# Altium schematic sheet Power_Supply.SchDoc
size A; SheetNumber: 1; SheetTotal: 3
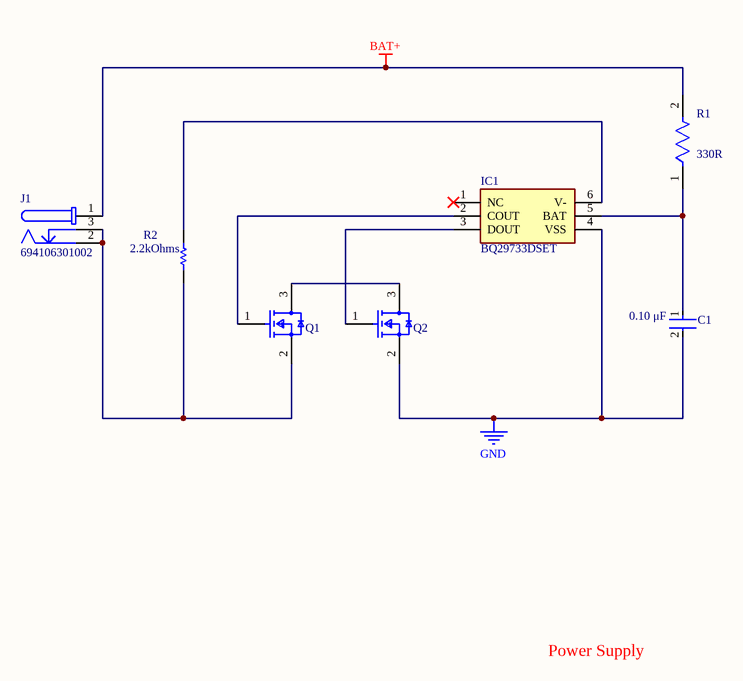
[diagram p0: Power_Supply.SchDoc]

## Parts
C1  Capacitance: 0.10 μF  [FP-C0603C-CF-MFG]  (hidden comment: C0603C104K5RACTU)
IC1  BQ29733DSET  [SON50P150X150X80-6N]
J1  694106301002  [694106301002]
Q1  2N7002-7-F  [FP-SOT23-MFG]  (value not drawn)
Q2  2N7002-7-F  [FP-SOT23-MFG]  (value not drawn)
R1  value 330R  [FP-ERA3A-MFG]  (hidden comment: ERA-3AEB331V)
R2  Resistance: 2.2kOhms  [RESC1608X55X25LL10T15]  (hidden comment: RC0603FR-072K2L)

## Nets
BAT+: J1.1 R1.2
GND: C1.2 IC1.4(VSS) Q2.2(S)
NetC1_1: C1.1 IC1.5(BAT) R1.1
NetIC1_2: IC1.2(COUT) Q1.1(G)
NetIC1_3: IC1.3(DOUT) Q2.1(G)
NetIC1_6: IC1.6(V-) R2.2
NetJ1_2: J1.2 J1.3 Q1.2(S) R2.1
NetQ1_3: Q1.3(D) Q2.3(D)

Not connected (* = marked no-connect by the designer): IC1 1(NC)*

## Notes on the sheet
- Power Supply

## Library data of the parts
C1 = CMP-2006-03061-2: CAP CER 0.1UF 50V X7R 0603; Manufacturer: KEMET; Tolerance: 0.1; Temperature Coefficient: 30ppm/°C; Material: Ceramic; Automotive Grade: Grade 1; Value: 0.10 μF; Multilayer: Yes; Tolerance  (fill in as +-): 10%; Temperature: -55°C to +125°C; RoHS: TRUE; Temperature Range High: +125°C; Lead Free: Yes; Octopart: https://octopart.com/c0603c104k5ractu-kemet-139244; Digikey Description: CAP CER 0.1UF 50V X7R 0603; Category: Cap; Package: C0603C-CF; ComponentLink2Description: Datasheet; Temperature Range Low: -55°C; Device Class L1: Passive Components; Voltage Rating: 50 V; Automotive: Yes; Device Class L3: Ceramic Capacitors; ComponentLink2URL: https://api.kemet.com/component-edge/download/datasheet/C0603C100J5GACAUTO.pdf; Device Class L2: Capacitors; Manufacturer Part Number: C0603C104K5RACTU; Temperature Characteristic: X7R; Height: 0.87mm; Supplier: Digikey; Supplier Part Number: 399-C0603C104K5RAC7867DKR-ND; Stock: 3980940; Pricing: 1=0.11, 10=0.074, 50=0.0424, 100=0.0329, 500=0.02474, 1000=0.01944 (USD); Mounting Technology: Surface Mount; Pins: 2; Dielectric Material: Ceramic; Package Shape: Rectangular; Case/Package: 0603; Terminal Finish: Nickel; Min Operating Temperature: -55°C; Max Operating Temperature: 125°C; JESD-609 Code: e3; Capacitor Type: Ceramic; Package Style: SMTMeter; Packaging: Tape and Reel; Tolerance (fill in as +-): 10%; Rated DC Voltage (URdc): 50V; Temperature Characteristics Code: X7R; Termination: Wraparound; Length: 1.6mm; Width: 0.8mm; Reach SVHC Compliant: Yes; RoHS Compliant: Yes; ComponentLink1URL: https://datasheet.ciiva.com:443/pdfs/VipMasterIC/IC/KEME/KEME-S-A0008991654/KEME-S-A0008991654-1.pdf?src-supplier=IHS+Markit; ComponentLink1Description: https://datasheet.ciiva.com:443/pdfs/VipMasterIC/IC/KEME/KEME-S-A0008991654/KEME-S-A0008991654-1.pdf?src-supplier=IHS+Markit
IC1 = BQ29733DSET: Power Supply Support Circuit, Fixed, 1 Channel, PDSO6; Manufacturer_Name: Texas Instruments; Package Body Material: Plastic; Adjustable Threshold: No; Number of Channels: 1; Max Supply Voltage: 8V; Min Supply Voltage: 1.5V; Nominal Supply Voltage: 3.6V; Datasheet Link: https://www.ti.com/lit/ds/symlink/bq2973.pdf?ts=1626159689941&ref_url=https%253A%252F%252Fwww.ti.com%252Fsitesearch%252Fdocs%252Funiversalsearch.tsp%253FlangPref%253Den-US%2526searchTerm%253DBQ29733DSET%2526nr%253D6; Height: 0.8mm; Manufacturer_Part_Number: BQ29733DSET; Mouser Part Number: 595-BQ29733DSET; Mouser Price/Stock: https://www.mouser.co.uk/ProductDetail/Texas-Instruments/BQ29733DSET?qs=zEmsApcVOkXfiFtBIYC8VA%3D%3D; Arrow Part Number: BQ29733DSET; Arrow Price/Stock: https://www.arrow.com/en/products/bq29733dset/texas-instruments?region=nac; Supplier: Digikey; Supplier Part Number: 296-BQ29733DSETCT-ND; Manufacturer: Texas Instruments; Manufacturer Part Number: BQ29733DSET; RoHS: Yes; Category: Battery Management; Stock: 5226; Pricing: 1=1.2, 10=1.076, 25=1.0208, 100=0.8386 (USD); Case/Package: VSON; Pins: 6; Package Shape: Square; Terminal Finish: Nickel; Min Operating Temperature: -40°C; Max Operating Temperature: 85°C; JESD-609 Code: e4; Throw Configuration: POWER SUPPLY SUPPORT CIRCUIT; JESD-30 Code: S-PDSO-N6; Moisture Sensitivity Level: 1; Channels: 1; Package Style: SMALL OUTLINE, VERY THIN PROFILEMeter; Peak Reflow Temperature (Cel): 260°C; Surface Mount: Yes; Terminal Form: No Lead; Terminal Position: DUAL; Length: 1.5mm; Width: 1.5mm; Height - Seated (Max): 0.8mm; Terminal Pitch: 0.5mm; Temperature Grade: INDUSTRIAL; Reach SVHC Compliant: Yes; RoHS Compliant: Yes; ComponentLink1URL: https://www.ti.com:443/lit/ds/symlink/bq2970.pdf?src-supplier=IHS+Markit; ComponentLink1Description: https://www.ti.com:443/lit/ds/symlink/bq2970.pdf?src-supplier=IHS+Markit; ComponentLink2URL: http://www.ti.com/lit/ds/symlink/bq2970.pdf?src-supplier=Digikey; ComponentLink2Description: http://www.ti.com/lit/ds/symlink/bq2970.pdf?src-supplier=Digikey
J1 = CMP-1502-00188-2: NexarPartId: 52676100; Manufacturer: Wurth Electronics; Voltage Rating (DC): 20V; Gender: Male; Voltage Rating: 24V; Connector Type: Power; Insulation Resistance: 100MΩ; Current Rating: 5A; Shielding: Unshielded; Number of Contacts: 3; Color: Black; Housing Material: Polyamide; Contact Gender: Female; REACH SVHC: Unknown; Termination: Through Hole; Height: 11mm; RoHS: Compliant; Mount: Through Hole; Flammability Rating: UL94 V-0; Packaging: Bulk; Min Operating Temperature: -40°C; Contact Plating: Tin; Max Operating Temperature: 85°C; Operating Supply Voltage: 24V; Contact Material: Gold, Tin; Supplier: Digikey; Supplier Part Number: 732-5930-ND; Manufacturer Part Number: 694106301002; Category: Power Connectors; Stock: 13785; Pricing: 1=1.02, 10=0.97, 50=0.86, 100=0.8, 500=0.69, 1000=0.59 (USD); Contact Finish - Mating: NOT SPECIFIED; Reach SVHC Compliant: Yes; RoHS Compliant: Yes; ComponentLink1URL: https://datasheet.ciiva.com:443/pdfs/VipMasterIC/IC/MIDC/MIDC-S-A0001192814/MIDC-S-A0001192814-1.pdf?src-supplier=IHS+Markit; ComponentLink1Description: https://datasheet.ciiva.com:443/pdfs/VipMasterIC/IC/MIDC/MIDC-S-A0001192814/MIDC-S-A0001192814-1.pdf?src-supplier=IHS+Markit; ComponentLink2URL: http://www.mouser.com/ds/2/445/6941xx301002-469315.pdf?src-supplier=Mouser; ComponentLink2Description: http://www.mouser.com/ds/2/445/6941xx301002-469315.pdf?src-supplier=Mouser; ComponentLink3URL: http://www.farnell.com/cad/2130967.pdf?src-supplier=Element14; ComponentLink3Description: http://www.farnell.com/cad/2130967.pdf?src-supplier=Element14; ComponentLink4URL: https://katalog.we-online.de/em/datasheet/6941xx301002.pdf?src-supplier=Digikey; ComponentLink4Description: https://katalog.we-online.de/em/datasheet/6941xx301002.pdf?src-supplier=Digikey
Q1 Q2 = CMP-2000-04929-2: MOSFET N-CH 60V 115MA SOT23-3; Manufacturer: Diodes; Turn-On Delay Time: 7ns; Turn-Off Delay Time: 11ns; Drain to Source Resistance: 7.5R; Rise Time: 3ns; Drain to Source Breakdown Voltage: 70V; Input Capacitance: 50pF; Number of Elements: 1; Power Dissipation: 540mW; Max Power Dissipation: 300mW; Fall Time: 5.6ns; Gate to Source Voltage (Vgs): 20V; Threshold Voltage: 2.5V; Element Configuration: Single; Package Body Material: Plastic; Transistor Element Material: SILICON; Operating Mode: ENHANCEMENT MODE; Time @ Peak Reflow Temperature-Max (s): 40s; Polarity/Channel Type: N-CHANNEL; Drain-source On Resistance-Max: 13.5R; Feedback Cap-Max (Crss): 5pF; FET Technology: METAL-OXIDE SEMICONDUCTOR; Transistor Application: SWITCHING; Qualification Status: Not Qualified; Termination: SMD/SMT; Weight: 0.000282oz; Radiation Hardening: No; Max Operating Temperature: 150°C; On-State Resistance: 7.5R; Mount: Surface Mount; Current Rating: 115mA; Contact Plating: Tin; Lead Free: Lead Free; Min Operating Temperature: -55°C; Number of Pins: 3; REACH SVHC: No SVHC; Drain to Source Voltage (Vdss): 60V; Width: 1.3mm; Package Quantity: 3000; Length: 2.9mm; Case/Package: SOT-23; Number of Channels: 1; Dual Supply Voltage: 60V; Packaging: Tape and Reel; Height: 1mm; Voltage Rating (DC): 60V; Nominal Vgs: 2.5V; Continuous Drain Current (ID): 115mA; Voltage: 60V; Rds On Max: 7.5R; Supplier: Digikey; Supplier Part Number: 2N7002-FDICT-ND; Manufacturer Part Number: 2N7002-7-F; RoHS: Yes; Category: MOSFETs; Stock: 590159; Pricing: 1=0.2, 10=0.139, 100=0.075, 500=0.0589, 1000=0.0409 (USD); Pins: 3; Package Shape: Rectangular; Terminal Finish: Tin; JESD-609 Code: e3; JESD-30 Code: R-PDSO-G3; Package Style: SMALL OUTLINEMeter; Peak Reflow Temperature (Cel): 260°C; Surface Mount: Yes; Terminal Form: Gull Wing; Terminal Position: DUAL; Drain Current-Max (Abs) (ID): 115mA; Drain Current-Max (ID): 115mA; DS Breakdown Voltage-Min: 60V; Moisture Sensitivity Level: 1; Power Dissipation-Max (Abs): 300mW; RoHS Compliant: Yes; Reach SVHC Compliant: Yes; ComponentLink1URL: https://datasheet.ciiva.com:443/pdfs/VipMasterIC/IC/DIOD/DIOD-S-A0009689736/DIOD-S-A0009691859-1.pdf?src-supplier=IHS+Markit; ComponentLink1Description: https://datasheet.ciiva.com:443/pdfs/VipMasterIC/IC/DIOD/DIOD-S-A0009689736/DIOD-S-A0009691859-1.pdf?src-supplier=IHS+Markit; ComponentLink2URL: https://datasheet.ciiva.com/15219/getdatasheetpartid-110059-15219667.pdf?src-supplier=Verical; ComponentLink2Description: https://datasheet.ciiva.com/15219/getdatasheetpartid-110059-15219667.pdf?src-supplier=Verical; ComponentLink3URL: https://datasheet.ciiva.com/3304/ds11303-3304385.pdf?src-supplier=Avnet; ComponentLink3Description: https://datasheet.ciiva.com/3304/ds11303-3304385.pdf?src-supplier=Avnet; ComponentLink4URL: https://datasheet.ciiva.com/1188/ds11303-1188363.pdf?src-supplier=Element14; ComponentLink4Description: https://datasheet.ciiva.com/1188/ds11303-1188363.pdf?src-supplier=Element14; ComponentLink5URL: https://datasheet.ciiva.com/22712/1915452-22712375.pdf?src-supplier=Element14; ComponentLink5Description: https://datasheet.ciiva.com/22712/1915452-22712375.pdf?src-supplier=Element14; ComponentLink6URL: https://datasheet.ciiva.com/49020/70437206-49020102.pdf?src-supplier=Allied+Electronics; ComponentLink6Description: https://datasheet.ciiva.com/49020/70437206-49020102.pdf?src-supplier=Allied+Electronics
R1 = CMP-2000-00036-3: NexarPartId: 1187882; Manufacturer: Panasonic; Voltage Rating (DC): 75V; Max Power Dissipation: 100mW; Resistance: 330Ω; Temperature Coefficient: 25ppm/°C; Tolerance: 0.1%; Rated Temperature: 85°C; Package Height: 0.45mm; Package Length: 1.6mm; Package Width: 0.8mm; Reference Standard: AEC-Q200; Features: Automotive AEC-Q200; Packaging: Cut Tape; Composition: Thin Film; Case Code (Imperial): 0603; Number of Terminations: 2; Termination: SMD/SMT; Military Standard: Not; Radiation Hardening: No; Voltage Rating: 75V; Width: 800µm; Schedule B: 8533210045, 8533210045; Min Operating Temperature: -55°C; Number of Pins: 2; Contact Plating: Tin; Length: 1.6mm; Case Code (Metric): 1608; Mount: Surface Mount; Lead Free: Lead Free; Power Rating: 100mW; Height: 450µm; Depth: 800µm; Max Operating Temperature: 155°C; RoHS: Compliant; Lifecycle Status: Production; REACH SVHC: No SVHC; Case/Package: 0603; Supplier: Digikey; Supplier Part Number: P330DBCT-ND; Manufacturer Part Number: ERA-3AEB331V; Category: Chip SMD Resistors; Stock: 139150; Pricing: 1=0.13, 10=0.094, 50=0.0742, 100=0.0665, 500=0.05062, 1000=0.04473 (USD); Mounting Technology: Surface Mount; Pins: 2; Terminal Finish: Nickel; Resistor Type: FIXED RESISTOR; Power: 100mW; Technology: THIN FILM; Working Voltage: 75V; Construction: Rectangular; Package Style: SMTMeter; JESD-609 Code: e3; RoHS Compliant: Yes; Reach SVHC Compliant: Yes; ComponentLink1URL: https://datasheet.ciiva.com:443/pdfs/VipMasterIC/IC/PANA/PANA-S-A0009459258/PANA-S-A0009459258-1.pdf?src-supplier=IHS+Markit; ComponentLink1Description: https://datasheet.ciiva.com:443/pdfs/VipMasterIC/IC/PANA/PANA-S-A0009459258/PANA-S-A0009459258-1.pdf?src-supplier=IHS+Markit; ComponentLink2URL: https://datasheet.ciiva.com/11808/0900766b80fe20f7-11808048.pdf?src-supplier=Rs; ComponentLink2Description: https://datasheet.ciiva.com/11808/0900766b80fe20f7-11808048.pdf?src-supplier=Rs; ComponentLink3URL: https://datasheet.ciiva.com/29183/450515-da-01-en-widerstand-0603-era-29183685.pdf?src-supplier=Conrad; ComponentLink3Description: https://datasheet.ciiva.com/29183/450515-da-01-en-widerstand-0603-era-29183685.pdf?src-supplier=Conrad; ComponentLink4URL: https://datasheet.ciiva.com/43455/485442-43455214.pdf?src-supplier=Farnell; ComponentLink4Description: https://datasheet.ciiva.com/43455/485442-43455214.pdf?src-supplier=Farnell; ComponentLink5URL: https://datasheet.ciiva.com/6000/485442-6000917.pdf?src-supplier=Farnell; ComponentLink5Description: https://datasheet.ciiva.com/6000/485442-6000917.pdf?src-supplier=Farnell; ComponentLink6URL: https://datasheet.ciiva.com/48530/era-eng-tds-48530552.pdf?src-supplier=Distrelec; ComponentLink6Description: https://datasheet.ciiva.com/48530/era-eng-tds-48530552.pdf?src-supplier=Distrelec; ComponentLink7URL: https://datasheet.ciiva.com/48425/era-eng-tds-48425455.pdf?src-supplier=Distrelec; ComponentLink7Description: https://datasheet.ciiva.com/48425/era-eng-tds-48425455.pdf?src-supplier=Distrelec; ComponentLink8URL: https://datasheet.ciiva.com/16395/aoa0000ce26-16395257.pdf?src-supplier=Future+Electronics; ComponentLink8Description: https://datasheet.ciiva.com/16395/aoa0000ce26-16395257.pdf?src-supplier=Future+Electronics; ComponentLink9URL: https://datasheet.ciiva.com/28673/485442-28673941.pdf?src-supplier=Element14; ComponentLink9Description: https://datasheet.ciiva.com/28673/485442-28673941.pdf?src-supplier=Element14; ComponentLink10URL: https://datasheet.ciiva.com/24124/aoa0000ce26-197354-24124473.pdf?src-supplier=Mouser; ComponentLink10Description: https://datasheet.ciiva.com/24124/aoa0000ce26-197354-24124473.pdf?src-supplier=Mouser; ComponentLink11URL: https://datasheet.ciiva.com/9182/aoa0000ce26-9182956.pdf?src-supplier=Avnet; ComponentLink11Description: https://datasheet.ciiva.com/9182/aoa0000ce26-9182956.pdf?src-supplier=Avnet; ComponentLink12URL: https://datasheet.ciiva.com/9117/aoa0000ce26-9117671.pdf?src-supplier=Avnet; ComponentLink12Description: https://datasheet.ciiva.com/9117/aoa0000ce26-9117671.pdf?src-supplier=Avnet
R2 = CMP-2000-06934-1: Thick Film Resistor, 2.2 KOhm, 100 mW, 50 V, +/- 1%, -55 to 155 degC, 2-Pin SMD (0603), RoHS, Tape and Reel; Manufacturer: Yageo; Temperature Coefficient: 100PPM/C; Voltage Rating: 50V; Power Rating: 100mW; Value: 2.2kR; Working Voltage: 75V; Rated Temperature: 70°C; Additional Feature: LASER TRIMMABLE; Package Height: 0.45mm; Package Length: 1.6mm; Package Width: 0.8mm; Tolerance: 1%; Datasheet Version: Rev. 7, 05/2017; Case Code - mm: 1608; Series: RC; Mounting Technology: SurfaceMount; Package Description: 2-Pin Surface Mount Device, Body 1.6 x 0.8 mm; Case Code - in: 0603; Package Reference: 0603; Product: ThickFilmResistorsGeneralPurpose; Manufacturer URL: http://www.yageo.com/; Termination Style: SMD/SMT; Operating Temperature Range: -55Cto+155C; Datasheet URL: http://www.yageo.com/documents/recent/PYu-RC_Group_51_RoHS_L_7.pdf; Packaging: Reel; Supplier: Digikey; Supplier Part Number: 311-2.20KHRCT-ND; Manufacturer Part Number: RC0603FR-072K2L; RoHS: Yes; Category: Chip SMD Resistors; Stock: 774281; Pricing: 1=0.1, 10=0.019, 50=0.0112, 100=0.0093, 500=0.00622, 1000=0.00532 (USD); Pins: 2; Case/Package: 0603; Terminal Finish: Nickel; Package Shape: Rectangular; Min Operating Temperature: -55°C; Max Operating Temperature: 155°C; Resistor Type: FIXED RESISTOR; Construction: Chip; Package Style: SMTMeter; Power: 100mW; Termination: Wraparound; JESD-609 Code: e3; Technology: METAL GLAZE/THICK FILM; Reach SVHC Compliant: Yes; RoHS Compliant: Yes; ComponentLink1URL: https://datasheet.ciiva.com:443/pdfs/VipMasterIC/IC/YAGO/YAGO-S-A0008145938/YAGO-S-A0008145938-1.pdf?src-supplier=IHS+Markit; ComponentLink1Description: https://datasheet.ciiva.com:443/pdfs/VipMasterIC/IC/YAGO/YAGO-S-A0008145938/YAGO-S-A0008145938-1.pdf?src-supplier=IHS+Markit; ComponentLink2URL: https://datasheet.ciiva.com/2453/pyu-r-int-thick-7-2453943.pdf?src-supplier=Digikey; ComponentLink2Description: https://datasheet.ciiva.com/2453/pyu-r-int-thick-7-2453943.pdf?src-supplier=Digikey; ComponentLink3URL: https://datasheet.ciiva.com/2453/pyu-r-int-thick-7-2453944.pdf?src-supplier=Digikey; ComponentLink3Description: https://datasheet.ciiva.com/2453/pyu-r-int-thick-7-2453944.pdf?src-supplier=Digikey; ComponentLink4URL: https://datasheet.ciiva.com/2453/pyu-r-int-thick-7-2453945.pdf?src-supplier=Digikey; ComponentLink4Description: https://datasheet.ciiva.com/2453/pyu-r-int-thick-7-2453945.pdf?src-supplier=Digikey